# EAGLE design WaterLevelMonitor_v1 (EAGLE 7.6.0)
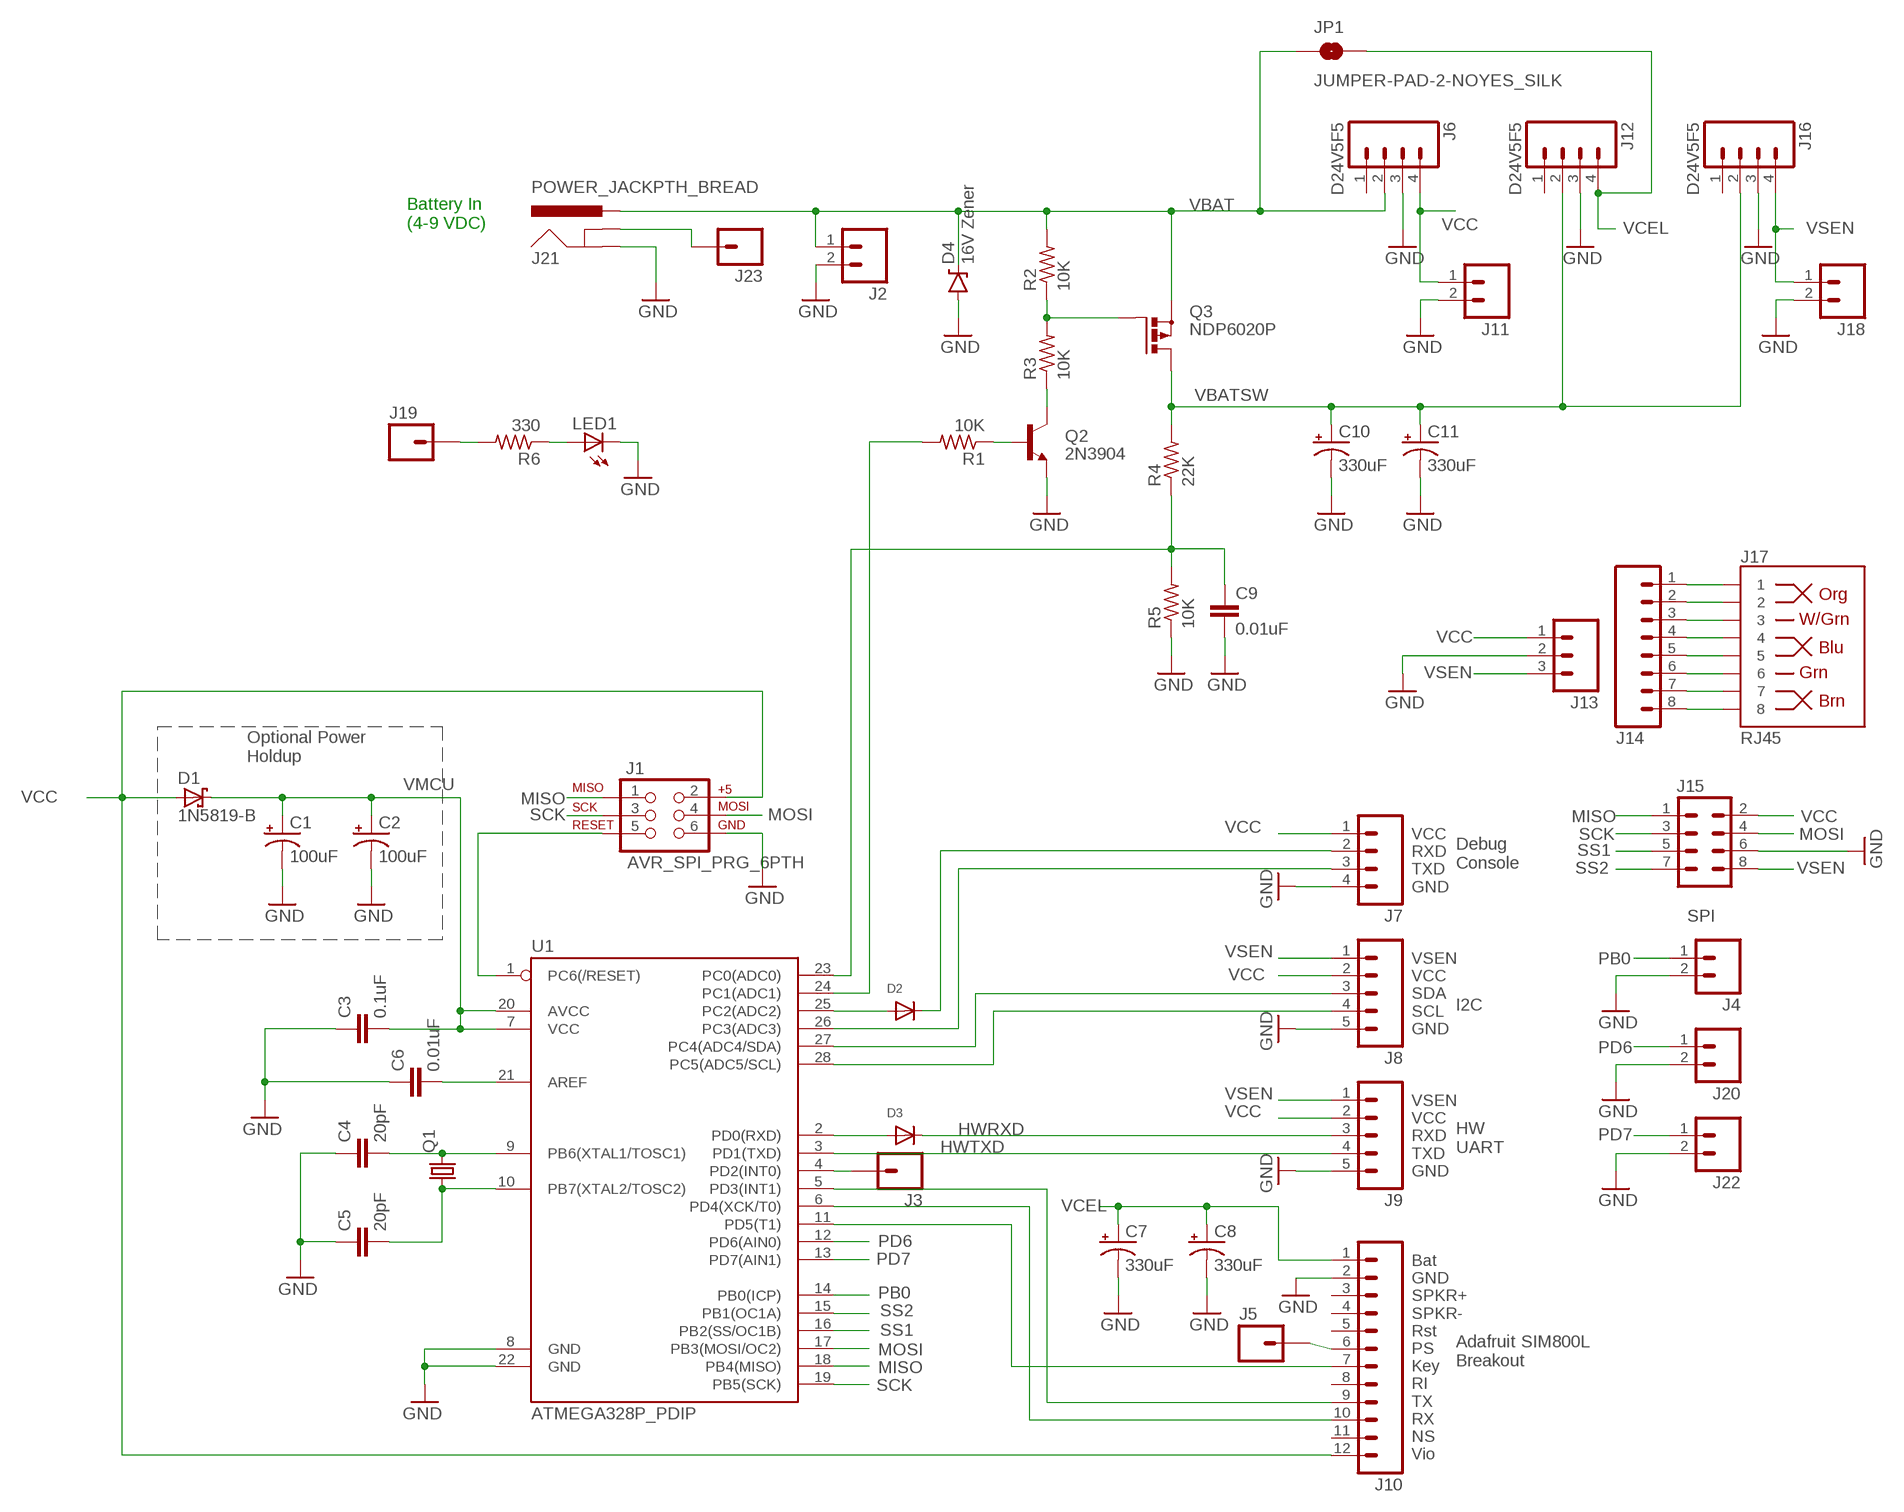
[diagram p0: schematic, sheet 1]

## Parts
C1  100uF  CAP_POLPTH1  [CPOL-RADIAL-100UF-25V]
C2  100uF  CAP_POLPTH1  [CPOL-RADIAL-100UF-25V]
C3  0.1uF  CAPPTH  [CAP-PTH-SMALL]
C4  20pF  CAPPTH  [CAP-PTH-SMALL]
C5  20pF  CAPPTH  [CAP-PTH-SMALL]
C6  0.01uF  CAPPTH1  [CAP-PTH-5MM]
C7  330uF  CAP_POLPTH1  [CPOL-RADIAL-100UF-25V]
C8  330uF  CAP_POLPTH1  [CPOL-RADIAL-100UF-25V]
C9  0.01uF  CAPPTH1  [CAP-PTH-5MM]
C10  330uF  CAP_POLPTH1  [CPOL-RADIAL-100UF-25V]
C11  330uF  CAP_POLPTH1  [CPOL-RADIAL-100UF-25V]
D1  1N5819-B  [DO41-7.6]
D2  DIODEDO-1N4148  [DO-1N4148]
D3  DIODEDO-1N4148  [DO-1N4148]
D4  16V Zener  DIODE-ZENERPTH  [DIODE-ZENER]
J1  AVR_SPI_PRG_6PTH  [2X3]
J2  M02PTH  [1X02]
J3  M01PTH_NO_SILK_YES_STOP  [1X01_NO_SILK]
J4  M021X02_NO_SILK  [1X02_NO_SILK]
J5  M01PTH_NO_SILK_YES_STOP  [1X01_NO_SILK]
J6  D24V5F5  M04PTH  [1X04]
J7  M04PTH  [1X04]
J8  M05PTH  [1X05]
J9  M05PTH  [1X05]
J10  M12PTH  [1X12]
J11  M02PTH  [1X02]
J12  D24V5F5  M04PTH  [1X04]
J13  M03PTH  [1X03]
J14  M08SILK_FEMALE_PTH  [1X08]
J15  M04X2  [2X4]
J16  D24V5F5  M04PTH  [1X04]
J17  RJ45  RJ45-8PTH  [RJ45-8]
J18  M02PTH  [1X02]
J19  M01PTH_NO_SILK_YES_STOP  [1X01_NO_SILK]
J20  M021X02_NO_SILK  [1X02_NO_SILK]
J21  POWER_JACKPTH_BREAD  [POWER_JACK_PTH_BREAD]
J22  M021X02_NO_SILK  [1X02_NO_SILK]
J23  M01PTH_NO_SILK_YES_STOP  [1X01_NO_SILK]
JP1  JUMPER-PAD-2-NOYES_SILK  [PAD-JUMPER-2-NO_YES_SILK]
LED1  LED5MM  [LED5MM]
Q1  CRYSTALHC49U-V  [HC49U-V]
Q2  2N3904  TRANSISTOR_NPNTO-92-AMMO  [TO-92-AMMO]
Q3  NDP6020P  PMOSFET_PTO220BV  [TO220BV]
R1  10K  R-US_0204/5  [0204/5]
R2  10K  R-US_0204/5  [0204/5]
R3  10K  R-US_0204/5  [0204/5]
R4  22K  R-US_0204/5  [0204/5]
R5  10K  R-US_0204/5  [0204/5]
R6  330  R-US_0204/5  [0204/5]
U1  ATMEGA328P_PDIP  [DIL28-3]

## Nets
GND: C1.2(-) C2.2(-) C3.1 C4.1 C5.1 C6.1 C7.2(-) C8.2(-) C9.2 C10.2(-) C11.2(-) D4.P$2(A) J1.6 J2.2 J4.2 J6.3 J7.4 J8.5 J9.5 J10.2 J11.2 J12.3 J13.2 J15.6 J16.3 J18.2 J20.2 J21.GND J22.2 LED1.K(C) Q2.1(E) R5.1 U1.8(GND) U1.22(GND)
HWRXD: D3.C J9.3
HWTXD: J9.4 U1.3(PD1(TXD))
MISO: J1.1 J15.1 U1.18(PB4(MISO))
MOSI: J1.4 J15.4 U1.17(PB3(MOSI/OC2))
N$1: J10.7 U1.11(PD5(T1))
N$2: Q3.G R2.1 R3.2
N$3: Q2.2(B) R1.1
N$4: J10.9 U1.5(PD3(INT1))
N$5: J3.1 U1.4(PD2(INT0))
N$6: C9.1 R4.1 R5.2 U1.23(PC0(ADC0))
N$7: J10.10 U1.6(PD4(XCK/T0))
N$8: J19.1 R6.2
N$9: C4.2 Q1.2 U1.9(PB6(XTAL1/TOSC1))
N$10: C5.2 Q1.1 U1.10(PB7(XTAL2/TOSC2))
N$11: C6.2 U1.21(AREF)
N$12: LED1.A R6.1
N$13: J5.1 J10.6
N$14: Q2.3(C) R3.1
N$15: D3.A U1.2(PD0(RXD))
N$16: J21.GNDBREAK J23.1
N$19: R1.2 U1.24(PC1(ADC1))
N$20: D2.A U1.25(PC2(ADC2))
N$21: D2.C J7.2
N$22: J7.3 U1.26(PC3(ADC3))
N$25: J8.3 U1.27(PC4(ADC4/SDA))
N$26: J8.4 U1.28(PC5(ADC5/SCL))
N$27: J14.1 J17.1
N$28: J14.2 J17.2
N$29: J14.3 J17.3
N$30: J14.4 J17.4
N$31: J14.5 J17.5
N$32: J1.5 U1.1(PC6(/RESET))
N$33: J14.6 J17.6
N$34: J14.7 J17.7
N$35: J14.8 J17.8
PB0: J4.1 U1.14(PB0(ICP))
PD6: J20.1 U1.12(PD6(AIN0))
PD7: J22.1 U1.13(PD7(AIN1))
SCK: J1.3 J15.3 U1.19(PB5(SCK))
SS1: J15.5 U1.16(PB2(SS/OC1B))
SS2: J15.7 U1.15(PB1(OC1A))
VBAT: D4.P$1(C) J2.1 J6.2 J21.PWR JP1.1 Q3.S R2.2
VBATSW: C10.1(+) C11.1(+) J12.2 J16.2 Q3.D R4.2
VCC: D1.A J1.2 J6.4 J7.1 J8.2 J9.2 J10.12 J11.1 J13.1 J15.2
VCEL: C7.1(+) C8.1(+) J10.1 J12.4 JP1.2
VMCU: C1.1(+) C2.1(+) C3.2 D1.C U1.7(VCC) U1.20(AVCC)
VSEN: J8.1 J9.1 J13.3 J15.8 J16.4 J18.1
Unconnected: J6.1 J10.3 J10.4 J10.5 J10.8 J10.11 J12.1 J16.1

## Notes on the sheet
- Battery In
  (4-9 VDC)
- Optional Power
  Holdup
- VCC
  RXD
  TXD
  GND
- Debug
  Console
- SPI
- VSEN
  VCC
  SDA
  SCL
  GND
- I2C
- VSEN
  VCC
  RXD
  TXD
  GND
- HW
  UART
- Bat
  GND
  SPKR+
  SPKR-
  Rst
  PS
  Key
  RI
  TX
  RX
  NS
  Vio
- Adafruit SIM800L
  Breakout

## Library data of the parts
C1 C2 C7 C8 C10 C11 = SparkFun-Capacitors:CAP_POL: Capacitor Polarized These are standard SMD and PTH capacitors. Normally 10uF, 47uF, and 100uF in electrolytic and tantalum varieties. Always verify the external diameter of the through hole cap, it varies with capacity, voltage, and manufacturer. The EIA devices should be standard.
C3-C5 = SparkFun-Capacitors:CAP: Capacitor Standard 0603 ceramic capacitor, and 0.1" leaded capacitor.
C6 C9 = SparkFun-Passives:CAP: Capacitor Standard 0603 ceramic capacitor, and 0.1" leaded capacitor.
D1 = diode:1N581*: 1.0A SCHOTTKY BARRIER RECTIFIER Source: http://www.diodes.com/datasheets/ds23001.pdf
D2 D3 = adafruit:DIODE: Diode SMADIODE - SMA Surface Mount Package 20V 1A Schottky Diode Digikey: 641-1014-6-ND DO-1N4148 - Through Hole Small Current Diode SOD-123 20V 1 A (.5mV Vf) Schottky Diode - Digikey: MBRX120TPMSCT-ND SOD-323 10V 570mA (.38mV Vf, 3ns) Schottky Diode - Digikey: ZLLS410CT-ND SOD-523 30V 30mA Schottky Diode (RB751S-40TE61) - Digikey: RB751S-40TE61CT-ND SOT23-R/W - SOT23 Package (R = Solder Paste/Reflow Ovens, W = Hand-Soldering) BAT54Film 40V 300mA - Digikey: 497-7162-1-ND
D4 = SparkFun-DiscreteSemi:DIODE-ZENER: Zener Diode Production Part - 8199 3.4V Zener Voltage
J1 = SparkFun-Connectors:AVR_SPI_PRG_6: AVR ISP 6 Pin This is the reduced ISP connector for AVR programming. Common on Arduino. This footprint will take up less PCB space and can be used with a 10-pin to 6-pin adapter such as SKU: BOB-08508 **Special note about "TEST_POINT" package. The stop mask is on the top side, so if you want your programming test points to be on the bottom of your board, make sure to place this package on the bottom side of the board. This also ensure that the orientation to program from the bottom side will be correct.
J2 J4 J11 J18 J20 J22 = SparkFun-Connectors:M02: Standard 2-pin 0.1" header. Use with - straight break away headers ( PRT-00116) - right angle break away headers (PRT-00553) - swiss pins (PRT-00743) - machine pins (PRT-00117) - female headers (PRT-00115) Molex polarized connector foot print use with: PRT-08233 with associated crimp pins and housings. 2.54_SCREWTERM for use with PRT-10571. 3.5mm Screw Terminal footprints for PRT-08084 5mm Screw Terminal footprints for use with PRT-08432
J3 J5 J19 J23 = SparkFun-Connectors:M01: Header 1 Standard 1-pin 0.1" header. Use with straight break away headers (SKU : PRT-00116), right angle break away headers (PRT-00553), swiss pins (PRT-00743), machine pins (PRT-00117), and female headers (PRT-00115). SMTSO-256-ET is a "flush mount" nut for a 4-40 screw. The older package used to be too tight, and did not allow it to sit properly thru the drill hit. The latest (0.165DIA) fits nice and snug.
J6 J7 J12 J16 = SparkFun-Connectors:M04: Header 4 Standard 4-pin 0.1" header. Use with straight break away headers (SKU : PRT-00116), right angle break away headers (PRT-00553), swiss pins (PRT-00743), machine pins (PRT-00117), and female headers (PRT-00115). Molex polarized connector foot print use with SKU : PRT-08231 with associated crimp pins and housings. 1MM SMD Version SKU: PRT-10208; PROD_ID: CONN-09696
J8 J9 = SparkFun-Connectors:M05: Header 5 Standard 5-pin 0.1" header. Use with straight break away headers (SKU : PRT-00116), right angle break away headers (PRT-00553), swiss pins (PRT-00743), machine pins (PRT-00117), and female headers (PRT-00115). Molex polarized connector foot print use with SKU : PRT-08230 with associated crimp pins and housings.
J10 = SparkFun-Connectors:M12: Header 12 Standard 12-pin 0.1" header. Use with straight break away headers (SKU : PRT-00116), right angle break away headers (PRT-00553), swiss pins (PRT-00743), machine pins (PRT-00117), and female headers (PRT-00115).
J13 = SparkFun-Connectors:M03: Header 3 Standard 3-pin 0.1" header. Use with straight break away headers (SKU : PRT-00116), right angle break away headers (PRT-00553), swiss pins (PRT-00743), machine pins (PRT-00117), and female headers (PRT-00115). Molex polarized connector foot print use with SKU : PRT-08232 with associated crimp pins and housings.
J14 = SparkFun-Connectors:M08: Header 8 Standard 8-pin 0.1" header. Use with straight break away headers (SKU : PRT-00116), right angle break away headers (PRT-00553), swiss pins (PRT-00743), machine pins (PRT-00117), and female headers (PRT-00115).; PROD_ID: CONN-08438
J15 = SparkFun-Connectors:M04X2: .1" header, two rows of four.
J17 = SparkFun-Connectors:RJ45-8: RJ45 Jack Simple RJ45, 8-pin connection - connector for common Cat5, Cat5e, and Cat6 Ethernet cables. Footprint not yet proven in production. Connector sku is PRT-00643; Breakout PCB sku is BOB-00716.; PROD_ID: CONN-08506
J21 = SparkFun-Connectors:POWER_JACK: Power Jack This is the standard 5.5mm barrel jack for power. The PTH is the most common, proven, reliable, footprint. The Slot footprint only works if the mill layer is transmitted to the PCB fab house so be warned. Mating wall wart : TOL-00298 (and others); PROD_ID: PRT-10811
JP1 = SparkFun-Passives:JUMPER-PAD-2-NO
LED1 = led:LED: LED OSRAM: - CHIPLED LG R971, LG N971, LY N971, LG Q971, LY Q971, LO R971, LY R971 LH N974, LH R974 LS Q976, LO Q976, LY Q976 LO Q996 - Hyper CHIPLED LW Q18S LB Q993, LB Q99A, LB R99A - SideLED LS A670, LO A670, LY A670, LG A670, LP A670 LB A673, LV A673, LT A673, LW A673 LH A674 LY A675 LS A676, LA A676, LO A676, LY A676, LW A676 LS A679, LY A679, LG A679 - Hyper Micro SIDELED® LS Y876, LA Y876, LO Y876, LY Y876 LT Y87S - SmartLED LW L88C, LW L88S LB L89C, LB L89S, LG L890 LS L89K, LO L89K, LY L89K LS L896, LA L896, LO L896, LY L896 - TOPLED LS T670, LO T670, LY T670, LG T670, LP T670 LSG T670, LSP T670, LSY T670, LOP T670, LYG T670 LG T671, LOG T671, LSG T671 LB T673, LV T673, LT T673, LW T673 LH T674 LS T676, LA T676, LO T676, LY T676, LB T676, LH T676, LSB T676, LW T676 LB T67C, LV T67C, LT T67C, LS T67K, LO T67K, LY T67K, LW E67C LS E67B, LA E67B, LO E67B, LY E67B, LB E67C, LV E67C, LT E67C LW T67C LS T679, LY T679, LG T679 LS T770, LO T770, LY T770, LG T770, LP T770 LB T773, LV T773, LT T773, LW T773 LH T774 LS E675, LA E675, LY E675, LS T675 LS T776, LA T776, LO T776, LY T776, LB T776 LHGB T686 LT T68C, LB T68C - Hyper Mini TOPLED® LB M676 - Mini TOPLED Santana® LG M470 LS M47K, LO M47K, LY M47K Source: http://www.osram.convergy.de LUXEON: - LUMILED® LXK2-PW12-R00, LXK2-PW12-S00, LXK2-PW14-U00, LXK2-PW14-V00 LXK2-PM12-R00, LXK2-PM12-S00, LXK2-PM14-U00 LXK2-PE12-Q00, LXK2-PE12-R00, LXK2-PE12-S00, LXK2-PE14-T00, LXK2-PE14-U00 LXK2-PB12-K00, LXK2-PB12-L00, LXK2-PB12-M00, LXK2-PB14-N00, LXK2-PB14-P00, LXK2-PB14-Q00 LXK2-PR12-L00, LXK2-PR12-M00, LXK2-PR14-Q00, LXK2-PR14-R00 LXK2-PD12-Q00, LXK2-PD12-R00, LXK2-PD12-S00 LXK2-PH12-R00, LXK2-PH12-S00 LXK2-PL12-P00, LXK2-PL12-Q00, LXK2-PL12-R00 Source: www.luxeon.com KINGBRIGHT: KA-3528ASYC Source: www.kingbright.com
Q1 = crystal:CRYSTAL: CRYSTAL; OC_FARNELL: 1666969; OC_NEWARK: unknown
Q2 = SparkFun-DiscreteSemi:TRANSISTOR_NPN: Generic NPN BJT MMBT2222A - TRANS-08049 (SOT-23, 1A 40V) MPSA42 - TRANS-09116 (SOT-23, 500mA 300V) MMBT5088LT1G - TRANS-11160 (SOT-23, 50 mA 30V) BC547 - COM-08928 <http://www.sparkfun.com/products/8928> (TO-92 45V 100mA) (1.Collector 2.Base 3.Emitter) 2N3904 - COM-00521 <http://www.sparkfun.com/products/521> (TO-92 40V 200mA) (1.Emitter 2.Base 3.Collector) P2N2222A - COM-12852 <http://www.sparkfun.com/products/12852> (TO-92 40V 600mA) (1.Collector 2.Base 3.Emitter)
Q3 = transistor-power:PMOSFET_P: Power MOSFET P-Channel
R1-R6 = resistor:R-US_: RESISTOR, American symbol
U1 = SparkFun-DigitalIC:ATMEGA328P_PDIP: uC used in the Arduino 32kb flash, 1k EEPROM, 2k SRAM This is the through-hole version of this chip.

## Board
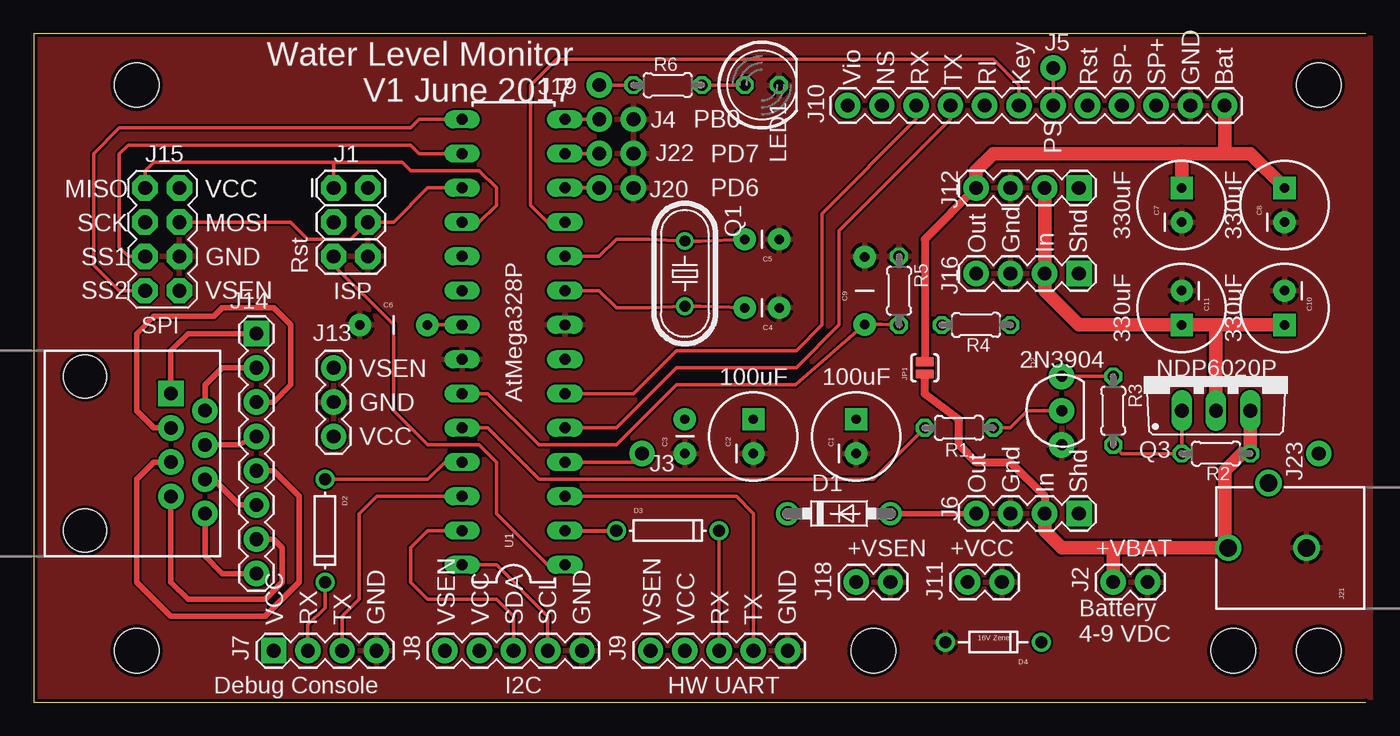
[diagram p1: board, top side]
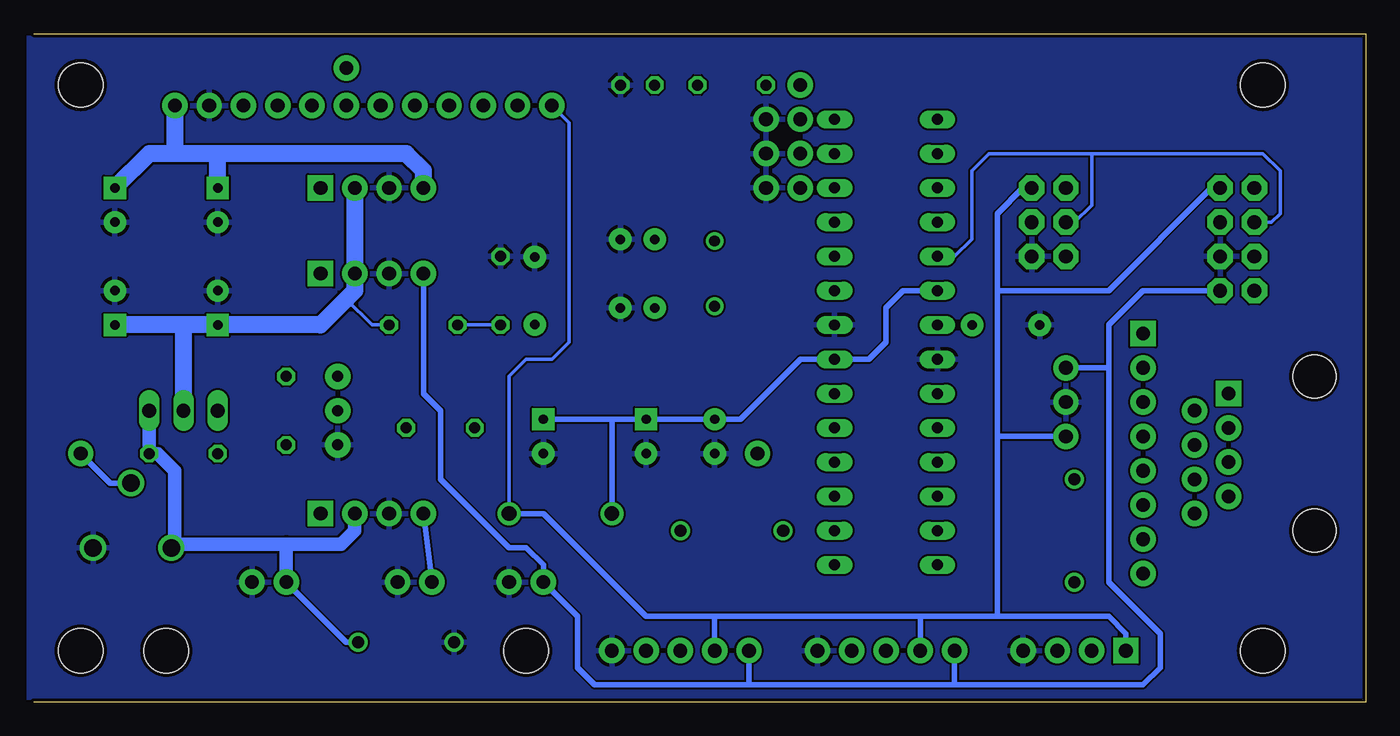
[diagram p2: board, bottom side, seen from below]

Size 98.73 x 49.52 mm. Coordinates in mm from the lower left corner, seen from the top.
Outline: 98.73,0 0,0 0,49.52 98.73,49.52
Copper layers (1*16): Top 0.035mm / dielectric 1.5mm / Bottom 0.035mm
Design rules "SeeedStudio_2layer_DRU_no_angle_20140221": minimum track width 6mil, minimum drill 12mil, track to track 6mil, track to pad 6mil, pad to pad 6mil, via to via 6mil, smd to smd 0mil, copper to edge 10mil, drill to drill 10mil, minimum pad ring 10mil, minimum via ring 6mil, stop-mask expansion 2mil, vias tented up to drill 100mil, thermal gap 10mil

### Footprints (pad centres in the part's own frame; a part is rotated, then mirrored left to right if it is on the bottom)
CPOL-RADIAL-100UF-25V = drill 0.7 pad 1.651 square: 1 1.27,0 | drill 0.7 pad 1.651: 2 -1.27,0
CAP-PTH-SMALL = drill 0.7 pad 1.651: 1 0,0; 2 2.54,0
CAP-PTH-5MM = drill 0.7 pad 1.651: 1 -2.5,0; 2 2.5,0
DO41-7.6 = drill 1.1 pad 1.7: A 3.81,0; C -3.81,0
DO-1N4148 = drill 0.9: A -3.81,0; C 3.81,0
DIODE-ZENER = drill 0.9: P$1 -3.556,0; P$2 3.556,0
2X3 = drill 1.016 pad 1.88 octagon: 1 0,0; 2 0,2.54; 3 2.54,0; 4 2.54,2.54; 5 5.08,0; 6 5.08,2.54
1X02 = drill 1.016 pad 1.88: 1 0,0; 2 2.54,0
1X01_NO_SILK = drill 1.016 pad 1.88: 1 0,0
1X02_NO_SILK = drill 1.016 pad 1.88: 1 0,0; 2 2.54,0
1X04 = drill 1.016 pad 1.88 square: 1 0,0 | drill 1.016 pad 1.88: 2 2.54,0; 3 5.08,0; 4 7.62,0
1X05 = drill 1.016 pad 1.88: 1 0,0; 2 2.54,0; 3 5.08,0; 4 7.62,0; 5 10.16,0
1X12 = drill 1.016 pad 1.88: 1 0,0; 2 2.54,0; 3 5.08,0; 4 7.62,0; 5 10.16,0; 6 12.7,0; 7 15.24,0; 8 17.78,0; 9 20.32,0; 10 22.86,0; 11 25.4,0; 12 27.94,0
1X03 = drill 1.016 pad 1.88: 1 0,0; 2 2.54,0; 3 5.08,0
1X08 = drill 1.016 pad 1.88 square: 1 0,0 | drill 1.016 pad 1.88: 2 2.54,0; 3 5.08,0; 4 7.62,0; 5 10.16,0; 6 12.7,0; 7 15.24,0; 8 17.78,0
2X4 = drill 1.016 pad 1.88 octagon: 1 -3.81,-1.27; 2 -3.81,1.27; 3 -1.27,-1.27; 4 -1.27,1.27; 5 1.27,-1.27; 6 1.27,1.27; 7 3.81,-1.27; 8 3.81,1.27
RJ45-8 = drill 1 pad 1.88 square: 1 -4.445,6.35 | drill 1 pad 1.88: 2 -3.175,8.89; 3 -1.905,6.35; 4 -0.635,8.89; 5 0.635,6.35; 6 1.905,8.89; 7 3.175,6.35; 8 4.445,8.89 | hole 3.2: -5.715,0; 5.715,0
POWER_JACK_PTH_BREAD = drill 1.3: GND 0,7.9; GNDBREAK 4.8,10.7; PWR 0,13.7
PAD-JUMPER-2-NO_YES_SILK = smd 0.635 x 1.27: 1 -0.45,0; 2 0.45,0
LED5MM = drill 0.813 octagon: A -1.27,0; K 1.27,0
HC49U-V = drill 0.813: 1 -2.413,0; 2 2.413,0
TO-92-AMMO = drill 0.813 pad 1.88: 1 -2.54,0; 2 0,0; 3 2.54,0
TO220BV = drill 1.016 long: D 0,-2.54; G -2.54,-2.54; S 2.54,-2.54
0204/5 = drill 0.813 octagon: 1 -2.54,0; 2 2.54,0
DIL28-3 = drill 0.813 long: 1 -16.51,-3.81; 2 -13.97,-3.81; 3 -11.43,-3.81; 4 -8.89,-3.81; 5 -6.35,-3.81; 6 -3.81,-3.81; 7 -1.27,-3.81; 8 1.27,-3.81; 9 3.81,-3.81; 10 6.35,-3.81; 11 8.89,-3.81; 12 11.43,-3.81; 13 13.97,-3.81; 14 16.51,-3.81; 15 16.51,3.81; 16 13.97,3.81; 17 11.43,3.81; 18 8.89,3.81; 19 6.35,3.81; 20 3.81,3.81; 21 1.27,3.81; 22 -1.27,3.81; 23 -3.81,3.81; 24 -6.35,3.81; 25 -8.89,3.81; 26 -11.43,3.81; 27 -13.97,3.81; 28 -16.51,3.81
STAND-OFF = hole 3.302: 0,0

### Placement (x,y rotation side)
C1  60.96,19.68 90 top
C2  53.34,19.68 90 top
C3  48.26,18.41 90 top
C4  55.24,29.21 180 top
C5  55.24,34.29 180 top
C6  26.67,27.94 0 top
C7  85.09,36.83 90 top
C8  92.71,36.83 90 top
C9  61.59,30.48 90 top
C10  92.71,29.21 270 top
C11  85.09,29.21 270 top
D1  59.69,13.97 0 top
D2  21.59,12.7 270 top
D3  46.99,12.7 0 top
D4  71.12,4.45 180 top
J1  22.23,38.1 270 top
J2  80.01,8.89 0 top
J3  45.09,18.41 0 top
J4  41.91,43.18 0 top
J5  75.56,46.99 0 top
J6  77.47,13.97 180 top
J7  17.78,3.81 0 top
J8  30.48,3.81 0 top
J9  45.72,3.81 0 top
J10  88.27,44.2 180 top
J11  69.22,8.89 0 top
J12  77.47,38.1 180 top
J13  22.23,19.68 90 top
J14  16.51,27.3 270 top
J15  9.53,34.29 270 top
J16  77.47,31.75 180 top
J17  3.81,18.41 270 top
J18  60.96,8.89 0 top
J19  41.91,45.72 0 top
J20  41.91,38.1 0 top
J21  102.23,11.43 90 top
J22  41.91,40.64 0 top
J23  95.25,18.41 0 top
JP1  66.04,24.77 90 top
LED1  53.98,45.72 0 top
Q1  48.26,31.75 270 top
Q2  76.2,21.59 90 top
Q3  87.63,24.13 0 top
R1  68.58,20.32 180 top
R2  87.63,18.41 0 top
R3  80.01,21.59 270 top
R4  69.85,27.94 0 top
R5  64.14,30.48 270 top
R6  46.99,45.72 180 top
U1  35.56,26.67 90 top
U$1  [STAND-OFF]  7.62,3.81 0 top
U$2  [STAND-OFF]  95.25,3.81 0 top
U$3  [STAND-OFF]  7.62,45.72 0 top
U$4  [STAND-OFF]  95.25,45.72 0 top
U$5  [STAND-OFF]  88.9,3.81 0 top
U$6  [STAND-OFF]  62.23,3.81 0 top

### Tracks (layer width: path | path; a pad name or v marks a point on that pad's centre or on a via)
GND
  pour Bottom: 0,0 0,49.53 99.06,49.53 99.06,0
  pour Top: 0,0 0,49.53 99.06,49.53 99.06,0
HWRXD
  Top 0.254: D3.C J9.3
HWTXD
  Top 0.254: U1.3 52.07,15.24 53.34,13.97 J9.4
MISO
  Top 0.254: U1.18 33.02,35.56 34.29,36.83 34.29,38.1 33.02,39.37 27.94,39.37 27.3,40.01 22.23,40.01 | J15.1 8.26,39.37 8.89,40.01 22.23,40.01 | J1.1 22.23,40.01
MOSI
  Top 0.254: U1.17 29.21,38.1 26.67,35.56 J1.4 23.5,34.29 20.32,34.29 19.05,35.56 J15.4
N$1
  Top 0.254: U1.11 38.1,35.56 36.83,36.83 36.83,45.72 38.73,47.62 71.12,47.62 73.03,45.72 J10.7
N$2
  Top 0.254: R3.2 80.64,18.41 R2.1 Q3.G
N$3
  Top 0.254: R1.1 72.39,20.32 73.66,21.59 Q2.2
N$4
  Top 0.254: U1.5 43.18,20.32 47.62,24.77 56.52,24.77 59.69,27.94 59.69,34.92 67.94,43.18 J10.9
N$5
  Top 0.254: U1.4 44.45,17.78 J3.1
N$6
  Top 0.254: U1.23 33.66,22.86 37.47,19.05 43.18,19.05 47.62,23.5 56.48,23.5 C9.1 62.83,27.98 R5.2
  Bottom 0.254: R4.1 R5.2
N$7
  Top 0.254: U1.6 44.45,22.86 47.62,26.04 56.52,26.04 58.42,27.94 58.42,36.2 65.41,43.18 J10.10
N$8
  Top 0.254: J19.1 R6.2
N$9
  Top 0.254: U1.9 41.91,30.48 43.18,29.21 45.59,29.21 Q1.2 49.4,29.34 C4.2
N$10
  Top 0.254: U1.10 41.91,33.02 43.18,34.29 45.59,34.29 Q1.1 49.4,34.16 C5.2
N$11
  Top 0.254: C6.2 U1.21
N$12
  Top 0.254: R6.1 LED1.A
N$13
  Top 0.254: J5.1 J10.6
N$14
  Top 0.254: Q2.3 R3.1
N$15
  Top 0.305: U1.2 D3.A
N$16
  Bottom 0.406: J21.GNDBREAK 93.06,16.23 J23.1
N$19
  Top 0.254: U1.24 33.66,20.32 37.47,16.51 62.23,16.51 R1.2
N$20
  Top 0.254: D2.A 29.21,16.51 30.48,17.78 U1.25
N$21
  Top 0.254: D2.C 21.59,6.99 20.32,5.71 J7.2
N$22
  Top 0.254: U1.26 25.4,15.24 24.13,13.97 24.13,7.62 22.86,6.35 J7.3
N$25
  Top 0.254: J8.3 35.56,6.35 34.29,7.62 29.21,7.62 27.94,8.89 27.94,11.43 29.21,12.7 U1.27
N$26
  Top 0.254: J8.4 38.1,6.35 34.29,10.16 U1.28
N$27
  Top 0.406: J17.1 10.16,26.04 11.43,27.3 J14.1
N$28
  Top 0.406: J17.2 12.7,23.5 13.97,24.77 J14.2
N$29
  Top 0.406: J17.3 8.89,20.32 7.62,21.59 7.62,27.3 8.89,28.57 13.34,28.57 13.97,29.21 17.78,29.21 19.05,27.94 19.05,23.5 17.78,22.23 J14.3
N$30
  Top 0.406: J17.4 15.24,19.05 J14.4
N$31
  Top 0.406: J17.5 8.89,17.78 7.62,16.51 7.62,8.89 10.16,6.35 17.14,6.35 19.68,8.89 19.68,15.24 17.78,17.14 J14.5
N$32
  Top 0.254: U1.1 38.1,10.16 34.29,13.97 34.29,17.78 33.02,19.05 29.21,19.05 26.67,21.59 26.67,27.94 22.23,32.38 J1.5
N$33
  Top 0.406: J17.6 13.34,16.51 15.24,14.61 J14.6
N$34
  Top 0.406: J17.7 10.16,8.89 11.43,7.62 17.14,7.62 18.41,8.89 18.41,11.43 17.78,12.06 J14.7
N$35
  Top 0.406: J17.8 12.7,10.79 13.97,9.53 J14.8
PB0
  Top 0.254: U1.14 J4.1
PD6
  Top 0.254: U1.12 J20.1
PD7
  Top 0.254: U1.13 J22.1
SCK
  Bottom 0.254: J1.3 21.59,35.56 20.32,36.83 20.32,40.64 | U1.19 30.48,33.02 29.21,34.29 29.21,39.37 27.94,40.64 20.32,40.64 | J15.3 6.99,35.56 6.35,36.2 6.35,39.37 7.62,40.64 20.32,40.64
SS1
  Top 0.254: J15.5 6.99,33.02 6.35,33.66 6.35,40.64 6.99,41.27 27.94,41.27 28.57,40.64 U1.16
SS2
  Top 0.254: U1.15 28.57,43.18 27.94,42.55 6.35,42.55 4.45,40.64 4.45,32.38 6.35,30.48 J15.7
VBAT
  Top 0.61: JP1.1 66.04,22.86 68.58,20.95 68.58,19.05 69.85,17.78 72.39,17.78 74.93,15.24 J6.2
  Top 1.016: Q3.S R2.2 89.53,18.41 88.27,17.14 88.27,11.43 80.01,11.43 | 80.01,11.43 76.2,11.43 74.93,12.7 J6.2 | J2.1 80.01,11.43
  Bottom 0.406: 90.42,18.67 R2.2 | 90.17,21.84 Q3.S | D4.P$1 75.56,4.45 J2.1
  Bottom 1.016: Q3.S R2.2 89.53,18.41 88.27,17.14 88.27,11.7 | 88.27,11.7 J21.PWR | 88.27,11.7 80.01,11.7 | 80.01,11.7 75.93,11.7 74.93,12.7 J6.2 | J2.1 80.01,11.7
VBATSW
  Top 1.016: J12.2 J16.2 74.93,30.48 77.47,27.94 C11.1 87.63,27.94 | 87.63,27.94 C10.1 | Q3.D 87.63,27.94
  Bottom 0.254: R4.2 73.66,27.94 75.56,29.84
  Bottom 1.27: J12.2 J16.2 74.93,30.48 75.56,29.84 77.47,27.94 C11.1 87.63,27.94 | 87.63,27.94 C10.1 | Q3.D 87.63,27.94
VCC
  Top 0.406: J6.4 D1.A
  Bottom 0.254: D1.A 63.5,24.13 62.23,25.4 60.33,25.4 59.05,26.67 59.05,42.93 J10.12
  Bottom 0.406: 48.26,6.35 53.34,6.35 60.96,13.97 D1.A | 48.26,6.35 33.02,6.35 | 33.02,6.35 27.3,6.35 | 27.3,6.35 19.05,6.35 17.78,5.08 J7.1 | J11.1 J6.4 | J9.2 48.26,6.35 | J8.2 33.02,6.35 | J1.2 25.4,38.1 27.3,36.2 27.3,30.48 | 27.3,30.48 27.3,19.68 | 27.3,19.68 27.3,6.35 | J13.1 27.3,19.68 | 27.3,30.48 19.05,30.48 11.43,38.1 J15.2
VCEL
  Top 0.61: J12.4 66.04,34.29 JP1.2
  Top 1.016: J12.4 69.85,39.37 71.12,40.64 85.09,40.64 | 85.09,40.64 88.27,40.64 | 88.27,40.64 90.17,40.64 C8.1 | 88.27,44.45 88.27,40.64 | C7.1 85.09,40.64
  Bottom 1.27: J12.4 69.85,39.37 71.12,40.64 85.09,40.64 | 85.09,40.64 88.27,40.64 | 88.27,40.64 90.17,40.64 C8.1 | J10.1 88.27,40.64 | C7.1 85.09,40.64
VMCU
  Bottom 0.406: U1.20 34.29,30.48 35.56,29.21 35.56,26.67 36.83,25.4 U1.7 41.91,25.4 46.35,20.95 C3.2 C2.1 55.88,20.95 | 55.88,20.95 C1.1 | D1.C 55.88,20.95
VSEN
  Bottom 0.406: 45.72,1.27 57.15,1.27 58.42,2.54 58.42,6.35 J18.1 60.96,10.16 62.23,11.43 63.5,11.43 68.58,16.51 68.58,21.59 69.85,22.86 J16.4 | 45.72,1.27 30.48,1.27 | 30.48,1.27 16.51,1.27 15.24,2.54 15.24,5.08 19.05,8.89 19.05,24.77 | J8.1 30.48,1.27 | J9.1 45.72,1.27 | 19.05,24.77 19.05,27.94 16.51,30.48 J15.8 | J13.3 19.05,24.77

### Text on the board
tPlace: Water Level Monitor / V1 June 2017 | Vio / NS / RX / TX / RI / Key / / Rst / SP- / SP+ / GND / Bat | PB0 | PS | PD7 / PD6 | 330uF | 330uF | Out / Gnd / In / Shd | Rst | MISO / SCK / SS1 / SS2 | VCC / MOSI / GND / VSEN | ISP | SPI | 330uF | 330uF | 2N3904 | NDP6020P | 100uF | 100uF | AtMega328P | VSEN / GND / VCC | Out / Gnd / In / Shd | +VSEN | +VCC | +VBAT | VCC / RX / TX / GND | VSEN / VCC / SDA / SCL / GND | VSEN / VCC / RX / TX / GND | Battery / 4-9 VDC | Debug Console | I2C | HW UART